# EAGLE schematic ScreenCircuitV0.1 (EAGLE 8.4.1)
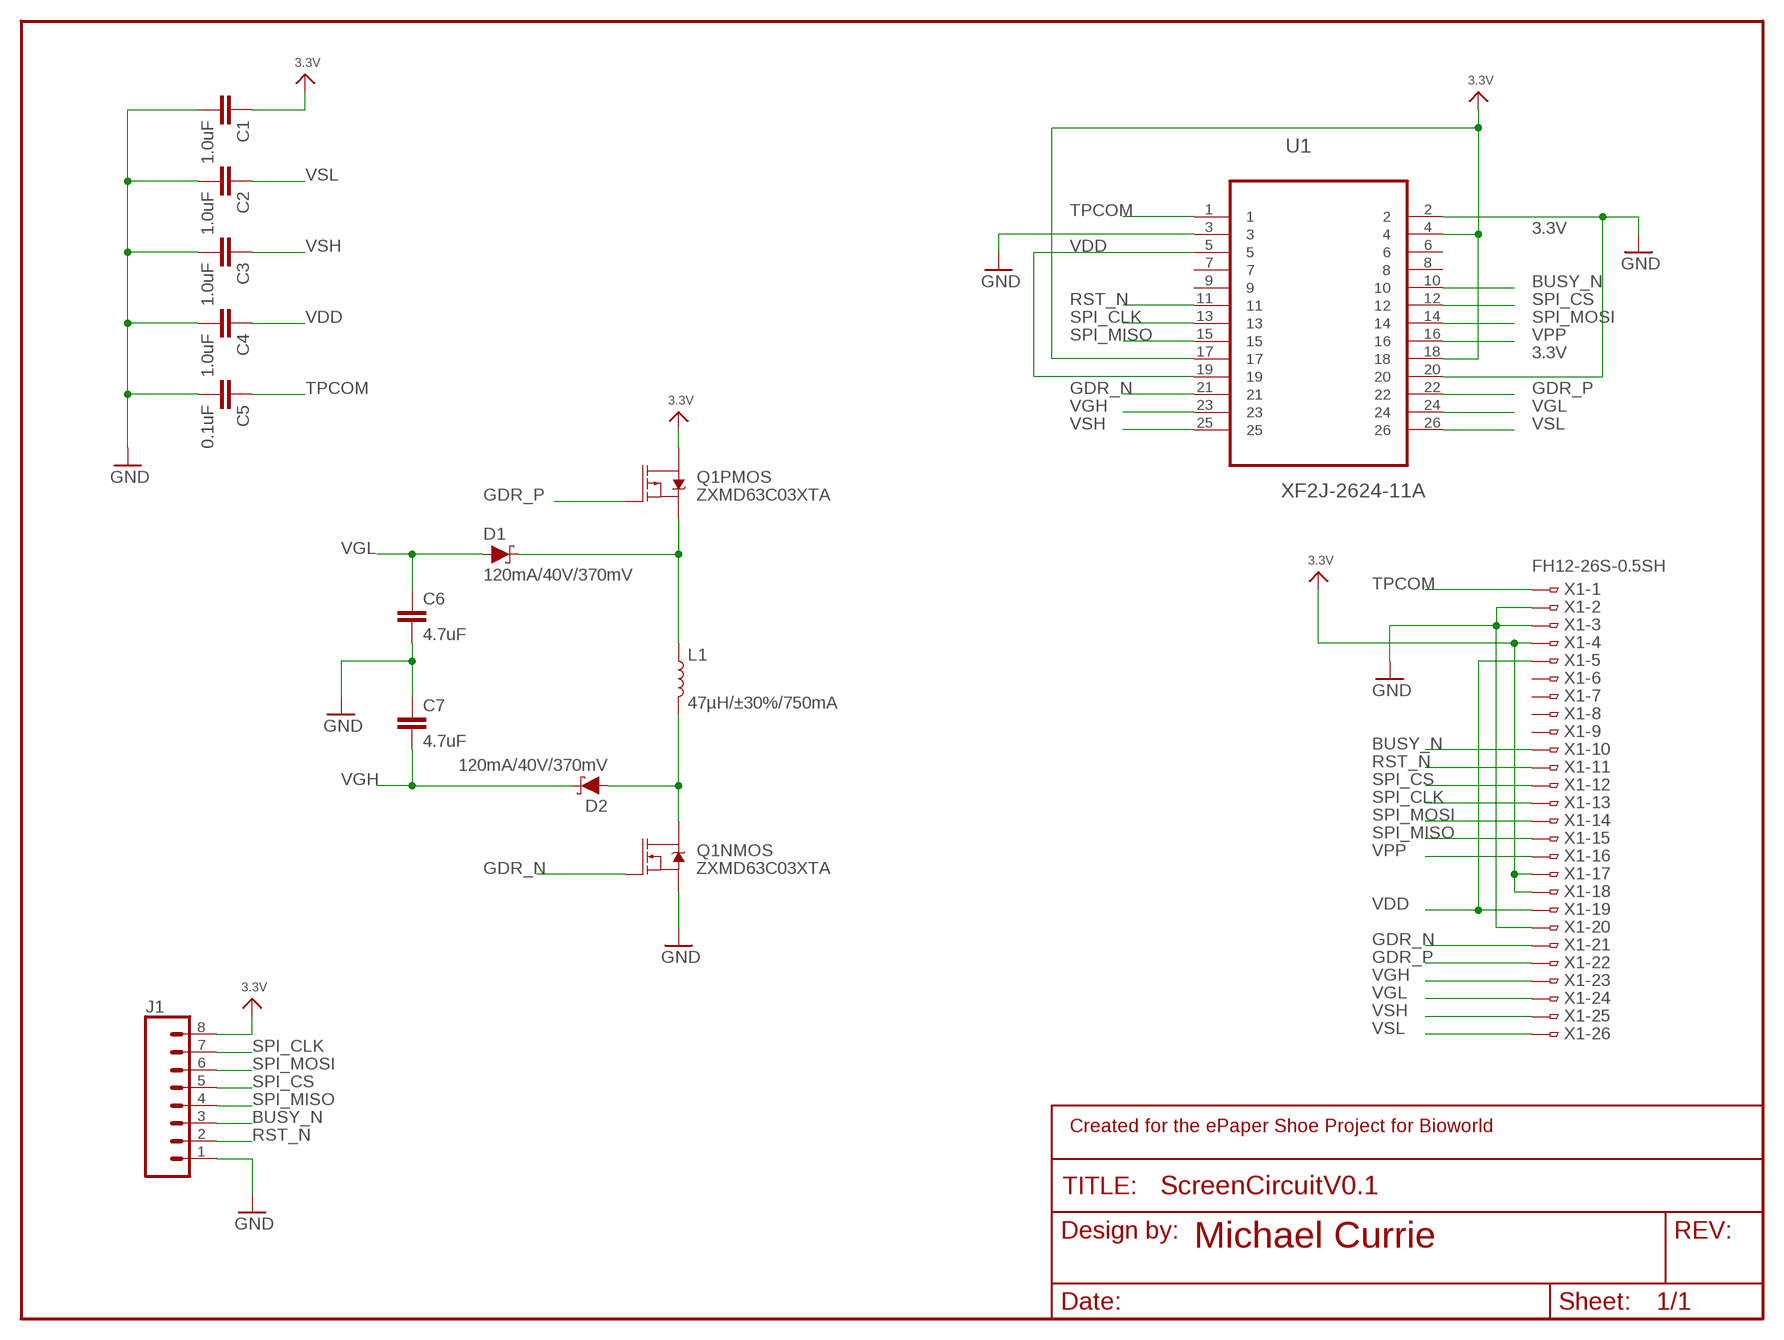
[diagram p0: schematic, sheet 1]

## Parts
C1  1.0uF  1.0UF-1206-50V-10%  [1206]
C2  1.0uF  1.0UF-1206-50V-10%  [1206]
C3  1.0uF  1.0UF-1206-50V-10%  [1206]
C4  1.0uF  1.0UF-1206-50V-10%  [1206]
C5  0.1uF  0.1UF-0603-100V-10%  [0603]
C6  4.7uF  4.7UF-1206-16V-(+80/-20%)  [1206]
C7  4.7uF  4.7UF-1206-16V-(+80/-20%)  [1206]
D1  120mA/40V/370mV  DIODE-SCHOTTKY-RB751S40  [SOD-523]
D2  120mA/40V/370mV  DIODE-SCHOTTKY-RB751S40  [SOD-523]
FRAME1  FRAME-LETTER-MICHAELNO_PACKAGE  [DUMMY]
J1  CONN_08"  [1X08]
L1  47µH/±30%/750mA  INDUCTOR-CR54-47UH  [CR54]
Q1  IRF7509  [MSOP8]
U1  XF2J-2624-11A  [OMRON_XF2J-2624-11A]
X1  FH12-26S-0.5SH  [FH12-26S-0.5SH]

## Nets
3.3V: C1.1 J1.8 Q1.5(PMOS:D) Q1.6(PMOS:D) U1.4 U1.17 U1.18 X1.4 X1.17 X1.18
BUSY_N: J1.3 U1.10 X1.10
GDR_N: Q1.2(NMOS:G) U1.21 X1.21
GDR_P: Q1.4(PMOS:G) U1.22 X1.22
GND: C1.2 C2.2 C3.2 C4.2 C5.2 C6.2 C7.1 J1.1 Q1.1(NMOS:S) U1.2 U1.3 U1.20 X1.2 X1.3 X1.20
N$3: D1.C L1.P$1 Q1.3(PMOS:S)
N$5: D2.A L1.P$2 Q1.7(NMOS:D) Q1.8(NMOS:D)
RST_N: J1.2 U1.11 X1.11
SPI_CLK: J1.7 U1.13 X1.13
SPI_CS: J1.5 U1.12 X1.12
SPI_MISO: J1.4 U1.15 X1.15
SPI_MOSI: J1.6 U1.14 X1.14
TPCOM: C5.1 U1.1 X1.1
VDD: C4.1 U1.5 U1.19 X1.5 X1.19
VGH: C7.2 D2.C U1.23 X1.23
VGL: C6.1 D1.A U1.24 X1.24
VPP: U1.16 X1.16
VSH: C3.1 U1.25 X1.25
VSL: C2.1 U1.26 X1.26
Unconnected: U1.6 U1.7 U1.8 U1.9 X1.6 X1.7 X1.8 X1.9

## Notes on the sheet
- ZXMD63C03XTA
- ZXMD63C03XTA

## Library data of the parts
C1-C4 = SparkFun-Capacitors:1.0UF: 1µF ceramic capacitors A capacitor is a passive two-terminal electrical component used to store electrical energy temporarily in an electric field.; PROD_ID: CAP-09822
C5 = SparkFun-Capacitors:0.1UF: 0.1µF ceramic capacitors A capacitor is a passive two-terminal electrical component used to store electrical energy temporarily in an electric field.; PROD_ID: CAP-08390
C6 C7 = SparkFun-Capacitors:4.7UF: 4.7µF ceramic capacitors A capacitor is a passive two-terminal electrical component used to store electrical energy temporarily in an electric field.; PROD_ID: CAP-10300
D1 D2 = SparkFun-DiscreteSemi:DIODE-SCHOTTKY: Schottky diode A Schottky diode is a semiconductor diode which has a low forward voltage drop and a very fast switching action.; PROD_ID: DIO-11018
FRAME1 = SparkFun-Aesthetics:FRAME-LETTER-MICHAEL: Schematic Frame - Letter Standard 8.5x11 US Letter frame; DESIGNER: Nobody; VERSION: v01
J1 = SparkFun-Connectors:CONN_08: Multi connection point. Often used as Generic Header-pin footprint for 0.1 inch spaced/style header connections On any of the 0.1 inch spaced packages, you can populate with these: Break Away Headers - Straight <https://www.sparkfun.com/products/116> (PRT-00116) Break Away Male Headers - Right Angle <https://www.sparkfun.com/products/553> (PRT-00553) Female Headers <https://www.sparkfun.com/products/115> (PRT-00115) Break Away Headers - Machine Pin <https://www.sparkfun.com/products/117> (PRT-00117) Break Away Female Headers - Swiss Machine Pin <https://www.sparkfun.com/products/743> (PRT-00743) Arduino Stackable Header - 8 Pin <https://www.sparkfun.com/products/9279> (PRT-09279) For SCREWTERMINALS and SPRING TERMINALS visit here: Screw Terimnals on SparkFun.com <https://www.sparkfun.com/search/results?term=Screw+Terminals> (5mm/3.5mm/2.54mm spacing) This device is also useful as a general connection point to wire up your design to another part of your project. Our various solder wires solder well into these plated through hole pads. Hook-Up Wire - Assortment (Stranded, 22 AWG) <https://www.sparkfun.com/products/11375> (PRT-11375) Hook-Up Wire - Assortment (Solid Core, 22 AWG) <https://www.sparkfun.com/products/11367> (PRT-11367) View the entire wire category on our website here <https://www.sparkfun.com/categories/141> Special notes: Molex polarized connector foot print use with SKU : PRT-08231 with associated crimp pins and housings. 1MM SMD Version SKU: PRT-10208 NOTES ON THE VARIANTS LOCK and LOCK_LONGPADS... This footprint was designed to help hold the alignment of a through-hole component (i.e. 6-pin header) while soldering it into place. You may notice that each hole has been shifted either up or down by 0.005 of an inch from it's more standard position (which is a perfectly straight line). This slight alteration caused the pins (the squares in the middle) to touch the edges of the holes. Because they are alternating, it causes a "brace" to hold the component in place. 0.005 has proven to be the perfect amount of "off-center" position when using our standard breakaway headers. Although looks a little odd when you look at the bare footprint, once you have a header in there, the alteration is very hard to notice. Also,if you push a header all the way into place, it is covered up entirely on the bottom side.; PROD_ID: CONN-08438
L1 = SparkFun-Coils:INDUCTOR: Inductors Resist changes in electrical current. Basically a coil of wire. SparkFun Products: SparkFun Load Cell Amplifier - HX711 <https://www.sparkfun.com/products/13879> IOIO-OTG - V2.2 <https://www.sparkfun.com/products/13613>; PROD_ID: NDUC-10789
Q1 = SparkFun-DiscreteSemi:IRF7509: Dual N and P Channel MOSFET Dual N/P-Channel 30V 1.25 W 7.8/7.5 nC Hexfet Power Mosfet Surface Mount-MICRO-8. NMOS RDS(ON) 0.11Ω. PMOS RDS(ON) 0.20Ω. Link to datasheet <http://www.irf.com/product-info/datasheets/data/irf7509pbf.pdf> SparkFun Products: SparkFun RedBot Mainboard <https://www.sparkfun.com/products/12097> SparkFun Wake on Shake <https://www.sparkfun.com/products/11447>; PROD_ID: TRANS-07913
U1 = OMRON ELECTRONIC COMPONENTS_By_element14_Batch_1:XF2J-2624-11A: FFC/FPC CONNECTOR, RECEPTACLE 26POS 1ROW; MPN: XF2J-2624-11A; OC_FARNELL: -; OC_NEWARK: 05M1981; PACKAGE: FFC/FPC CONNECTOR, RECEPTACLE 26POS 1ROW; SUPPLIER: OMRON ELECTRONIC COMPONENTS
X1 = con-hirose:FH12-26S-0.5S: 0.5mm Pitch Connectors For FPC/FFC Source: Data sheet <http://www.hirose.co.jp/cataloge_hp/e58605370.pdf>; MPN: FH12-26S-0.5SH(55); OC_FARNELL: 1324553; OC_NEWARK: 34M6172